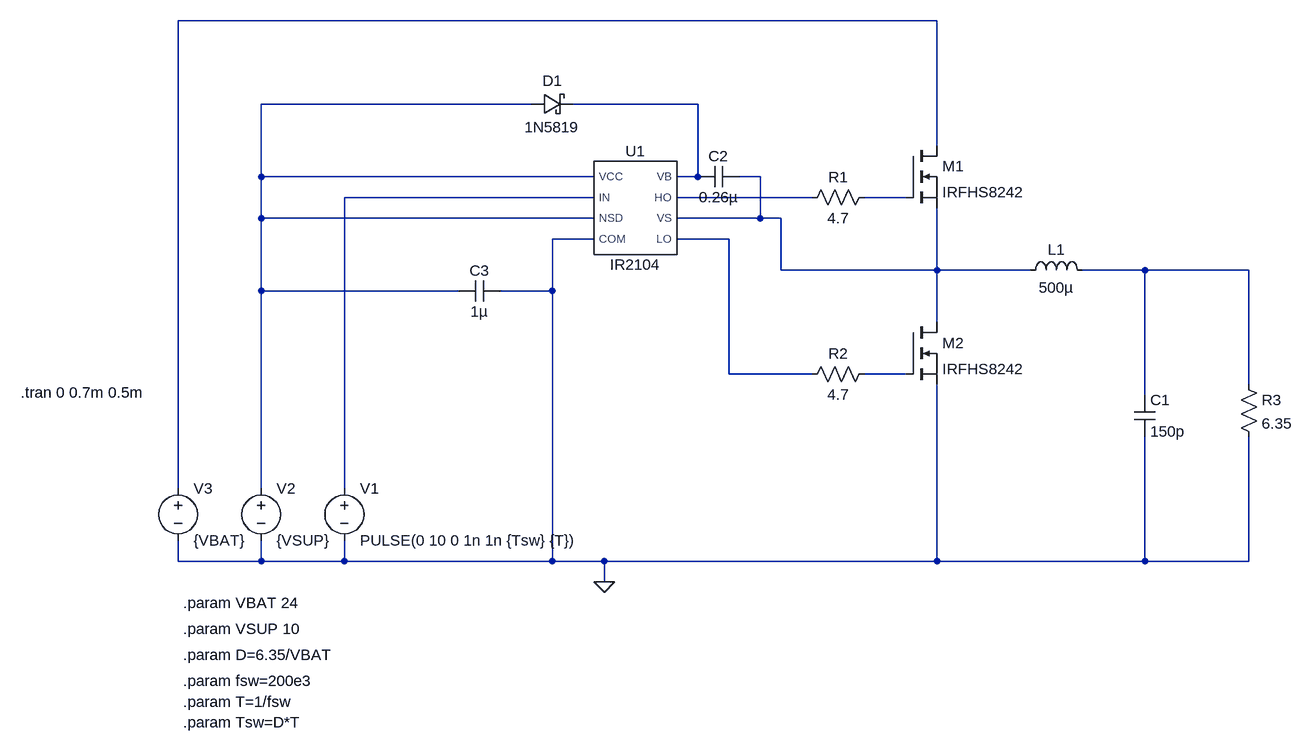
[diagram p0: schematic BUCKDRIVER.asc]
BUCKDRIVER.asc, the LTspice schematic file:
Version 4
SHEET 1 1212 956
WIRE 656 -160 -512 -160
WIRE 32 -32 -384 -32
WIRE 288 -32 96 -32
WIRE 656 32 656 -160
WIRE -384 80 -384 -32
WIRE 128 80 -384 80
WIRE 288 80 288 -32
WIRE 288 80 256 80
WIRE 384 80 352 80
WIRE 128 112 -256 112
WIRE 464 112 256 112
WIRE 608 112 544 112
WIRE -384 144 -384 80
WIRE 128 144 -384 144
WIRE 384 144 384 80
WIRE 384 144 256 144
WIRE 416 144 384 144
WIRE 128 176 64 176
WIRE 336 176 256 176
WIRE 416 224 416 144
WIRE 656 224 656 128
WIRE 656 224 416 224
WIRE 800 224 656 224
WIRE 976 224 880 224
WIRE 1136 224 976 224
WIRE -384 256 -384 144
WIRE -80 256 -384 256
WIRE 64 256 64 176
WIRE 64 256 -16 256
WIRE 656 304 656 224
WIRE 336 384 336 176
WIRE 464 384 336 384
WIRE 608 384 544 384
WIRE 1136 400 1136 224
WIRE 976 416 976 224
WIRE -512 560 -512 -160
WIRE -384 560 -384 256
WIRE -256 560 -256 112
WIRE -512 672 -512 640
WIRE -384 672 -384 640
WIRE -384 672 -512 672
WIRE -256 672 -256 640
WIRE -256 672 -384 672
WIRE 64 672 64 256
WIRE 64 672 -256 672
WIRE 144 672 64 672
WIRE 656 672 656 400
WIRE 656 672 144 672
WIRE 976 672 976 480
WIRE 976 672 656 672
WIRE 1136 672 1136 480
WIRE 1136 672 976 672
WIRE 144 704 144 672
FLAG 144 704 0
SYMBOL AutoGenerated\\IR2104 192 128 R0
SYMATTR InstName U1
SYMBOL nmos 608 32 R0
SYMATTR InstName M1
SYMATTR Value IRFHS8242
SYMBOL res 560 96 R90
WINDOW 0 0 56 VBottom 2
WINDOW 3 32 56 VTop 2
SYMATTR InstName R1
SYMATTR Value 4.7
SYMBOL res 560 368 R90
WINDOW 0 0 56 VBottom 2
WINDOW 3 32 56 VTop 2
SYMATTR InstName R2
SYMATTR Value 4.7
SYMBOL nmos 608 304 R0
SYMATTR InstName M2
SYMATTR Value IRFHS8242
SYMBOL voltage -256 544 R0
WINDOW 123 0 0 Left 0
WINDOW 39 0 0 Left 0
SYMATTR InstName V1
SYMATTR Value PULSE(0 10 0 1n 1n {Tsw} {T})
SYMBOL voltage -384 544 R0
WINDOW 123 0 0 Left 0
WINDOW 39 0 0 Left 0
SYMATTR InstName V2
SYMATTR Value {VSUP}
SYMBOL voltage -512 544 R0
WINDOW 123 0 0 Left 0
WINDOW 39 0 0 Left 0
SYMATTR InstName V3
SYMATTR Value {VBAT}
SYMBOL ind 784 240 R270
WINDOW 0 32 56 VTop 2
WINDOW 3 5 56 VBottom 2
SYMATTR InstName L1
SYMATTR Value 500µ
SYMBOL cap 960 416 R0
SYMATTR InstName C1
SYMATTR Value 150p
SYMBOL res 1120 384 R0
SYMATTR InstName R3
SYMATTR Value 6.35
SYMBOL schottky 32 -16 R270
WINDOW 0 36 32 VTop 2
WINDOW 3 -4 32 VBottom 2
SYMATTR InstName D1
SYMATTR Value 1N5819
SYMATTR Description Zener Diode
SYMATTR Type zener
SYMBOL cap 352 64 R90
WINDOW 0 0 32 VBottom 2
WINDOW 3 32 32 VTop 2
SYMATTR InstName C2
SYMATTR Value 0.26µ
SYMBOL cap -16 240 R90
WINDOW 0 0 32 VBottom 2
WINDOW 3 32 32 VTop 2
SYMATTR InstName C3
SYMATTR Value 1µ
TEXT -504 736 Left 2 !.param VBAT 24
TEXT -504 776 Left 2 !.param VSUP 10
TEXT -504 816 Left 2 !.param D=6.35/VBAT
TEXT -504 856 Left 2 !.param fsw=200e3
TEXT -504 920 Left 2 !.param Tsw=D*T
TEXT -504 888 Left 2 !.param T=1/fsw
TEXT -754 412 Left 2 !.tran 0 0.7m 0.5m

The netlist it stands for:
* BUCKDRIVER.asc
XU1 N008 N006 0 N005 N002 N003 N004 N002 IR2104  ; pins LO HO COM IN VCC VB VS NSD
M1 N001 N007 N004 N004 IRFHS8242
R1 N007 N006 4.7
R2 N010 N008 4.7
M2 N004 N010 0 0 IRFHS8242
V1 N005 0 PULSE(0 10 0 1n 1n {Tsw} {T})
V2 N002 0 {VSUP}
V3 N001 0 {VBAT}
L1 N004 N009 500µ
C1 N009 0 150p
R3 N009 0 6.35
D1 N002 N003 1N5819
C2 N004 N003 0.26µ
C3 0 N002 1µ
.model D D
.lib standard.dio
.model NMOS NMOS
.model PMOS PMOS
.lib standard.mos
.param VBAT 24
.param VSUP 10
.param D=6.35/VBAT
.param fsw=200e3
.param Tsw=D*T
.param T=1/fsw
.tran 0 0.7m 0.5m
.lib C:\Users\---\Desktop\DCE\dce-g5-proyecto_integrador\Checkpoint 4\Buck\IR2104.lib
.backanno
.end